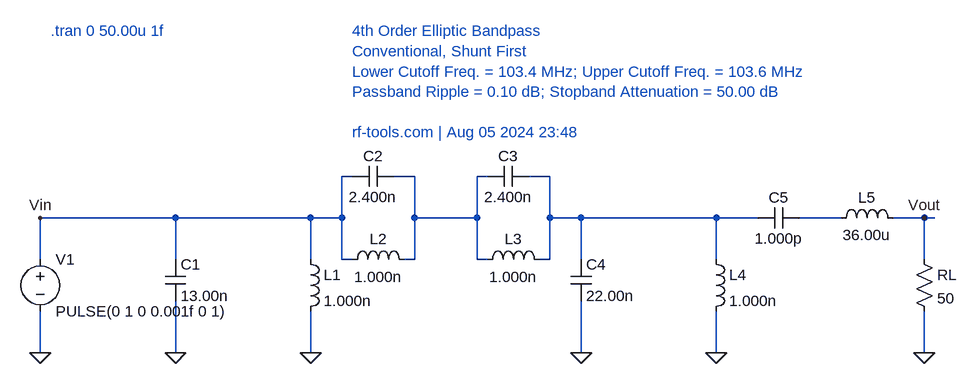
[diagram p0: schematic filter (1).asc]
filter (1).asc, the LTspice schematic file:
Version 4
SHEET 1 1200 400
WIRE 0 0 0 64
WIRE 0 144 0 208
WIRE 0 0 208 0
WIRE 208 0 208 64
WIRE 208 128 208 208
WIRE 208 0 416 0
WIRE 416 0 416 64
WIRE 416 144 416 208
WIRE 416 0 464 0
WIRE 464 0 464 64
WIRE 464 0 464 -64
WIRE 464 64 480 64
WIRE 464 -64 480 -64
WIRE 544 -64 560 -64
WIRE 560 -64 576 -64
WIRE 560 64 576 64
WIRE 576 64 576 0
WIRE 576 -64 576 0
WIRE 576 0 624 0
WIRE 624 0 672 0
WIRE 672 0 672 64
WIRE 672 0 672 -64
WIRE 672 64 688 64
WIRE 672 -64 688 -64
WIRE 752 -64 768 -64
WIRE 768 -64 784 -64
WIRE 768 64 784 64
WIRE 784 64 784 0
WIRE 784 -64 784 0
WIRE 784 0 832 0
WIRE 832 0 832 64
WIRE 832 128 832 208
WIRE 832 0 1040 0
WIRE 1040 0 1040 64
WIRE 1040 144 1040 208
WIRE 1040 0 1104 0
WIRE 1168 0 1232 0
WIRE 1312 0 1376 0
WIRE 1360 0 1360 64
WIRE 1360 144 1360 208
FLAG 0 0 Vin
FLAG 0 208 0
FLAG 208 208 0
FLAG 416 208 0
FLAG 832 208 0
FLAG 1040 208 0
FLAG 1360 208 0
FLAG 1360 0 Vout
SYMBOL voltage 0 48 R0
WINDOW 123 40 48 Left 2
WINDOW 39 39 77 Left 2
SYMATTR InstName V1
SYMATTR Value PULSE(0 1 0 0.001f 0 1)
SYMBOL cap 192 64 R0
SYMATTR InstName C1
SYMATTR Value 13.00n
SYMBOL ind 400 48 R0
SYMATTR InstName L1
SYMATTR Value 1.000n
SYMBOL cap 480 -48 R270
SYMATTR InstName C2
SYMATTR Value 2.400n
WINDOW 0 32 32 VTop 2
WINDOW 3 0 32 VBottom 2
SYMBOL ind 464 80 R270
SYMATTR InstName L2
SYMATTR Value 1.000n
WINDOW 0 32 56 VTop 2
WINDOW 3 5 56 VBottom 2
SYMBOL cap 688 -48 R270
SYMATTR InstName C3
SYMATTR Value 2.400n
WINDOW 0 32 32 VTop 2
WINDOW 3 0 32 VBottom 2
SYMBOL ind 672 80 R270
SYMATTR InstName L3
SYMATTR Value 1.000n
WINDOW 0 32 56 VTop 2
WINDOW 3 5 56 VBottom 2
SYMBOL cap 816 64 R0
SYMATTR InstName C4
SYMATTR Value 22.00n
SYMBOL ind 1024 48 R0
SYMATTR InstName L4
SYMATTR Value 1.000n
SYMBOL cap 1104 16 R270
SYMATTR InstName C5
SYMATTR Value 1.000p
WINDOW 0 32 32 VTop 2
WINDOW 3 0 32 VBottom 2
SYMBOL ind 1216 16 R270
SYMATTR InstName L5
SYMATTR Value 36.00u
WINDOW 0 32 56 VTop 2
WINDOW 3 5 56 VBottom 2
SYMBOL res 1344 48 R0
SYMATTR InstName RL
SYMATTR Value 50
TEXT 16 -288 Left 2 .tran 0 50.00u 1f
TEXT 480 -288 Left 2 ;4th Order Elliptic Bandpass\nConventional, Shunt First\nLower Cutoff Freq. = 103.4 MHz; Upper Cutoff Freq. = 103.6 MHz\nPassband Ripple = 0.10 dB; Stopband Attenuation = 50.00 dB\n\nrf-tools.com | Aug 05 2024 23:48

The netlist it stands for:
* filter (1).asc
V1 Vin 0 PULSE(0 1 0 0.001f 0 1)
C1 Vin 0 13.00n
L1 Vin 0 1.000n
C2 Vin N001 2.400n
L2 Vin N001 1.000n
C3 N001 N002 2.400n
L3 N001 N002 1.000n
C4 N002 0 22.00n
L4 N002 0 1.000n
C5 N002 N003 1.000p
L5 N003 Vout 36.00u
RL Vout 0 50
* .tran 0 50.00u 1f
* 4th Order Elliptic Bandpass
* Conventional, Shunt First
* Lower Cutoff Freq. = 103.4 MHz; Upper Cutoff Freq. = 103.6 MHz
* Passband Ripple = 0.10 dB; Stopband Attenuation = 50.00 dB
* rf-tools.com | Aug 05 2024 23:48
.backanno
.end